# EAGLE design discoball-v2 (EAGLE 9.5.0)
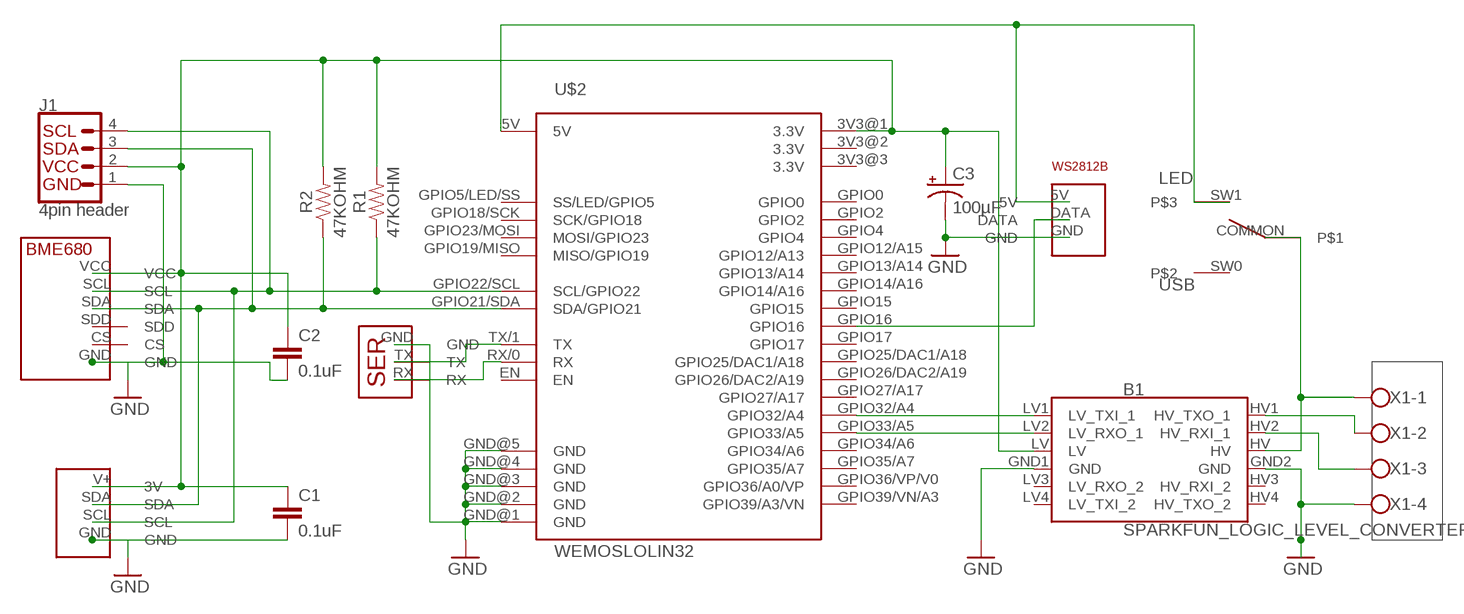
[diagram p0: schematic, sheet 1]

## Parts
B1  SPARKFUN_LOGIC_LEVEL_CONVERTER  [SPARKFUN_LOGIC_LEVEL_CONVERTER]
C1  0.1uF  0.1UF-KIT-EZ-50V-20%  [CAP-PTH-SMALL-KIT]
C2  0.1uF  0.1UF-KIT-EZ-50V-20%  [CAP-PTH-SMALL-KIT]
C3  100µF  CAP_POLPTH1  [CPOL-RADIAL-100UF-25V]
J1  4pin header  QWIIC_CONNECTORJS-1MM  [1X04_1MM_RA]
R1  47KOHM  [AXIAL-0.3-KIT]
R2  47KOHM  [AXIAL-0.3-KIT]
U$1  BME680BREAKOUT  [BME680BREAKOUT]
U$2  WEMOSLOLIN32  [LOLIN32VAR1]
U$3  I2CHEADER  [I2CHEADER]
U$4  SPDTSWITCH  [SPDTSWITCH]
U$6  SERIALHEADER  [SERIALHEADER]
U$7  WS2812BHEADER  [WS2812BHEADER]
X1  W237-4  [W237-4]

## Nets
3.3V: B1.LV C1.1 C2.1 C3.1(+) J1.2(VCC) R1.P$2 R2.P$2 U$1.VCC U$2.3V3@1(3.3V) U$3.V+(3V)
5V: U$2.5V U$4.SW1 U$7.5V
GND: B1.GND1(GND) B1.GND2(GND) C1.2 C2.2 C3.2(-) J1.1(GND) U$1.GND U$2.GND@1(GND) U$2.GND@2(GND) U$2.GND@3(GND) U$2.GND@4(GND) U$2.GND@5(GND) U$3.GND U$6.GND U$7.GND X1.4
N$1: J1.4(SCL) R1.P$1 U$1.SCL U$2.GPIO22/SCL(SCL/GPIO22) U$3.SCL
N$2: J1.3(SDA) R2.P$1 U$1.SDA U$2.GPIO21/SDA(SDA/GPIO21) U$3.SDA
N$3: B1.HV2(HV_RXI_1) X1.3
N$4: U$2.RX/0(RX) U$6.RX
N$5: B1.LV1(LV_TXI_1) U$2.GPIO32/A4
N$6: B1.LV2(LV_RXO_1) U$2.GPIO33/A5
N$7: U$2.TX/1(TX) U$6.TX
N$8: B1.HV1(HV_TXO_1) X1.2
N$9: B1.HV U$4.COMMON X1.1
N$11: U$2.GPIO16 U$7.DATA
Unconnected: B1.HV3(HV_RXI_2) B1.HV4(HV_TXO_2) B1.LV3(LV_RXO_2) B1.LV4(LV_TXI_2) U$1.CS U$1.SDD U$2.3V3@2(3.3V) U$2.EN U$2.GPIO0 U$2.GPIO2 U$2.GPIO4 U$2.GPIO5/LED/SS(SS/LED/GPIO5) U$2.GPIO12/A15(GPIO12/A13) U$2.GPIO13/A14 U$2.GPIO14/A16 U$2.GPIO15 U$2.GPIO17 U$2.GPIO18/SCK(SCK/GPIO18) U$2.GPIO19/MISO(MISO/GPIO19) U$2.GPIO23/MOSI(MOSI/GPIO23) U$2.GPIO25/DAC1/A18 U$2.GPIO26/DAC2/A19 U$2.GPIO27/A17 U$2.GPIO34/A6 U$2.GPIO35/A7 U$2.GPIO36/VP/V0(GPIO36/A0/VP) U$2.GPIO39/VN/A3(GPIO39/A3/VN) U$4.SW0

## Notes on the sheet
- LED
- USB

## Power pins joined to a net without a drawn wire
3.3V: U$2.3V3@3(3.3V)

## Library data of the parts
B1 = SparkFun-Boards:SPARKFUN_LOGIC_LEVEL_CONVERTER: SparkFun Logic Level Converter -Bi-Directional This is the mechnical outline for the 3.3V - 5V bi directional logic level converter. *Note, the "LOCK" Package has the header pins staggered by an offset of 5 mils (off center line), so that when you slide a row of standard 0.1" headers into the PTH pads, it will hold position vertically. See the follwing turorial for more information on this type of special footprints: Sneaky Footprints <https://www.sparkfun.com/tutorials/114> SparkFun Products: SparkFun Logic Level Converter - Bi-Directional <https://www.sparkfun.com/products/12009>
C1 C2 = SparkFun-Capacitors:0.1UF: 0.1µF ceramic capacitors A capacitor is a passive two-terminal electrical component used to store electrical energy temporarily in an electric field.; PROD_ID: CAP-08370
C3 = SparkFun:CAP_POL: Capacitor Polarized These are standard SMD and PTH capacitors. Normally 10uF, 47uF, and 100uF in electrolytic and tantalum varieties. Always verify the external diameter of the through hole cap, it varies with capacity, voltage, and manufacturer. The EIA devices should be standard.
J1 = SparkFun-Connectors:QWIIC_CONNECTOR: SparkFun I2C Standard Qwiic Connector An SMD 1mm pitch JST connector makes it easy and quick (get it? Qwiic?) to connect I2C devices to each other. The Qwiic system <http://www.sparkfun.com/qwiic> enables fast and solderless connection between popular platforms and various sensors and actuators. We carry 200mm <https://www.sparkfun.com/products/14204>, 100mm <https://www.sparkfun.com/products/14205>, 50mm <https://www.sparkfun.com/products/14206>, and breadboard friendly <https://www.sparkfun.com/products/14207> Qwiic cables. We also offer 10 pcs strips <https://www.sparkfun.com/products/14323> the SMD connectors.
R1 R2 = LOLIN32:47KOHM: 47kΩ resistor A resistor is a passive two-terminal electrical component that implements electrical resistance as a circuit element. Resistors act to reduce current flow, and, at the same time, act to lower voltage levels within circuits. - Wikipedia
U$1 = LOLIN32:BME680BREAKOUT
U$2 = LOLIN32:WEMOSLOLIN32: WEMOS LOLIN32 CPU with Wifi and 4Gb flash storage
U$3 = LOLIN32:I2CHEADER
U$4 = LOLIN32:SPDTSWITCH
U$6 = LOLIN32:SERIALHEADER
U$7 = LOLIN32:WS2812BHEADER: WS2812B RGB LED header
X1 = con-wago-500:W237-4: WAGO SCREW CLAMP; OC_FARNELL: unknown; OC_NEWARK: unknown

## Board
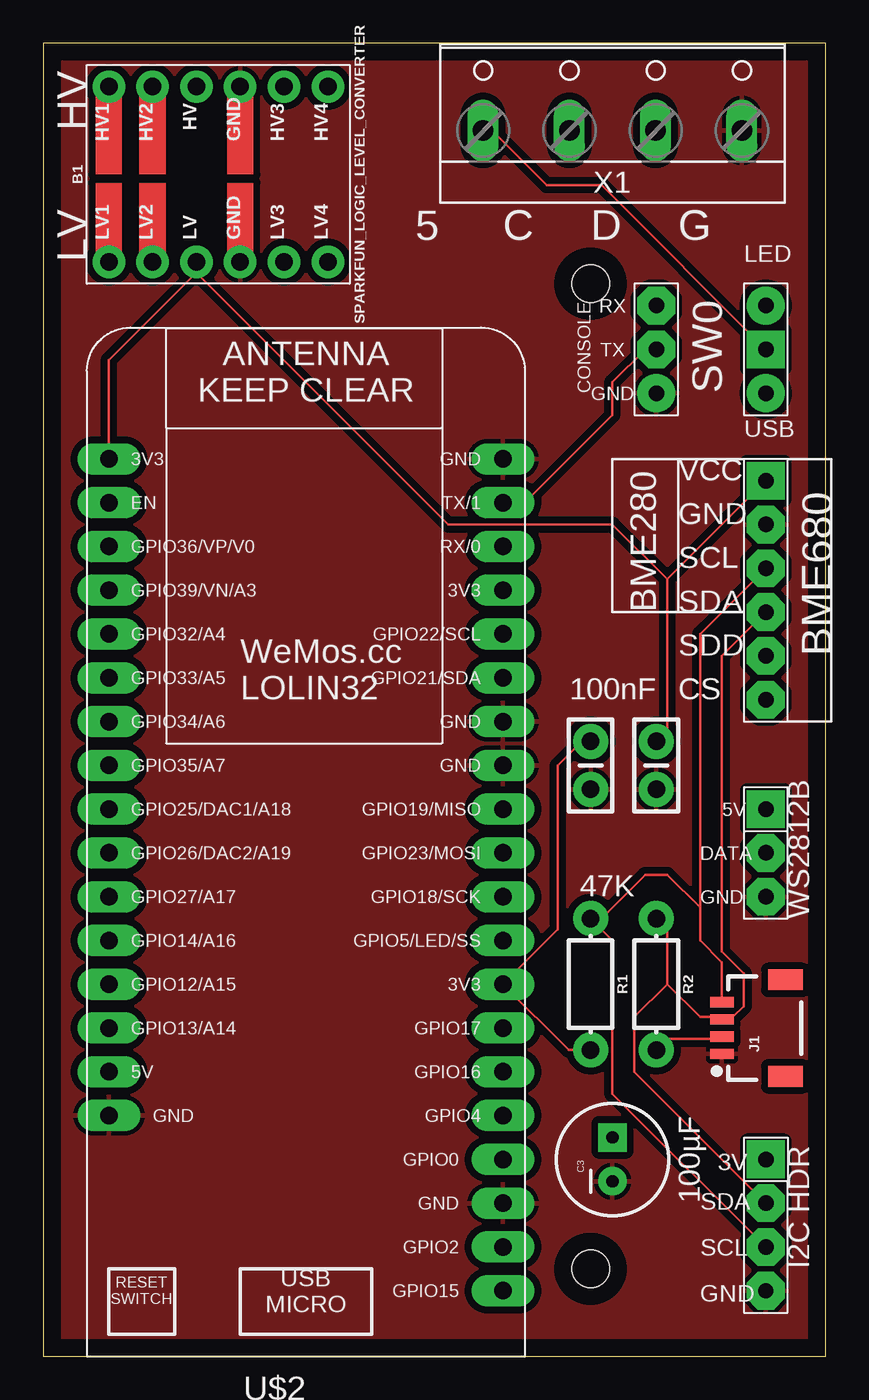
[diagram p1: board, top side]
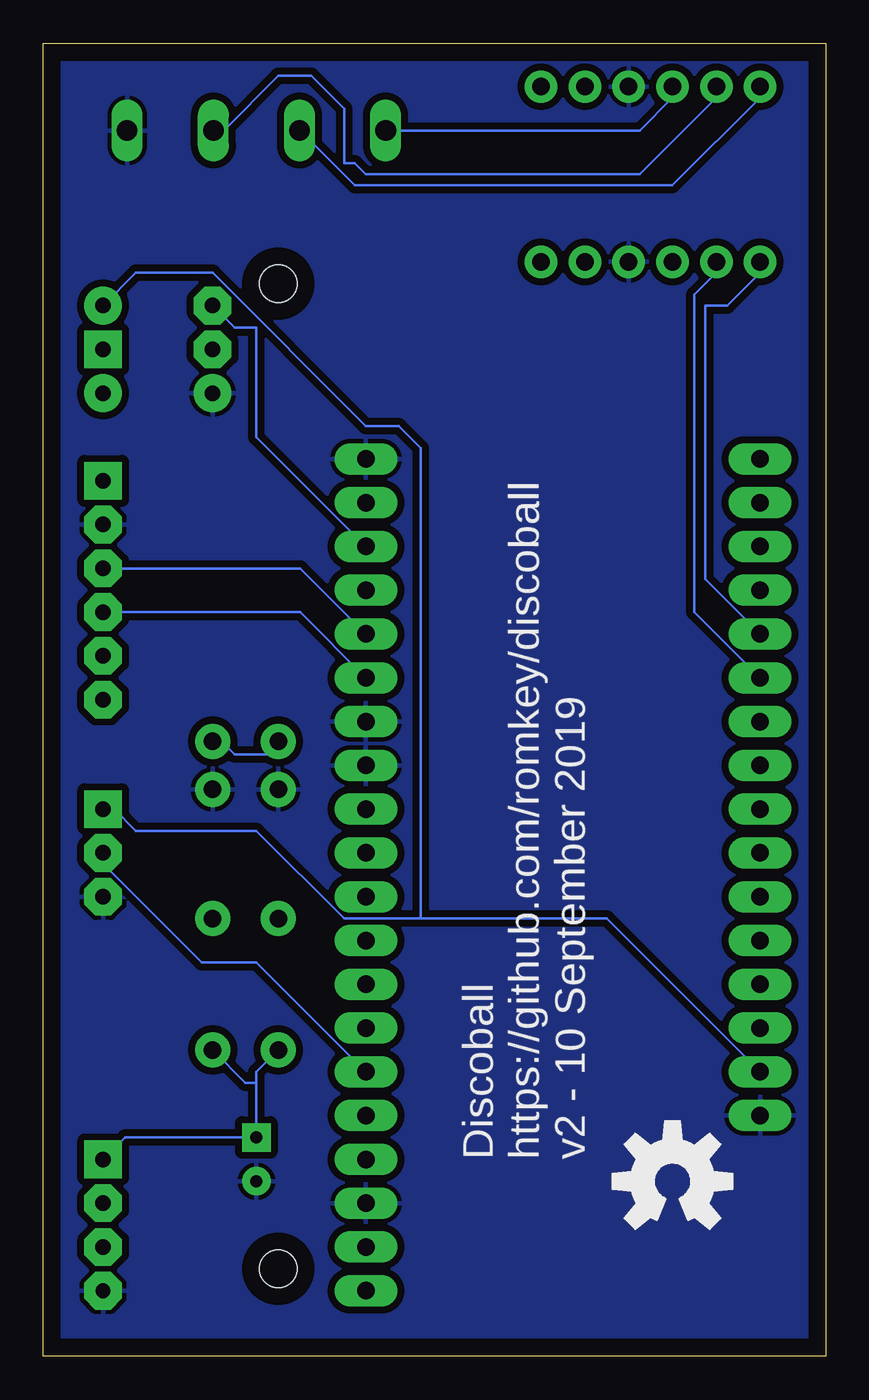
[diagram p2: board, bottom side, seen from below]

Size 45.39 x 76.19 mm. Coordinates in mm from the lower left corner, seen from the top.
Outline: 0,0 45.39,0 45.39,76.19 0,76.19 0,0
Copper layers (1*16): Top 0.035mm / dielectric 1.5mm / Bottom 0.035mm
Design rules "default": minimum track width 6mil, minimum drill 0.35mm, track to track 6mil, track to pad 6mil, pad to pad 6mil, via to via 6mil, smd to smd 6mil, copper to edge 40mil, drill to drill 6mil, minimum pad ring 10mil, minimum via ring 8mil, stop-mask expansion 4mil, vias tented up to drill 0mil, thermal gap 10mil
Holes 2.16 mm at 31.75,5.08 31.75,62.23

### Footprints (pad centres in the part's own frame; a part is rotated, then mirrored left to right if it is on the bottom)
SPARKFUN_LOGIC_LEVEL_CONVERTER = drill 1.016 pad 1.88: GND1 -5.08,-1.27; GND2 5.08,-1.27; HV 5.08,1.27; HV1 5.08,6.35; HV2 5.08,3.81; HV3 5.08,-3.81; HV4 5.08,-6.35; LV -5.08,1.27; LV1 -5.08,6.35; LV2 -5.08,3.81; LV3 -5.08,-3.81; LV4 -5.08,-6.35
CAP-PTH-SMALL-KIT = drill 1.016 pad 2.032: 1 -1.397,0; 2 1.397,0
CPOL-RADIAL-100UF-25V = drill 0.7 pad 1.651 square: 1 1.27,0 | drill 0.7 pad 1.651: 2 -1.27,0
1X04_1MM_RA = smd 0.6 x 1.35: 1 -1.5,0; 2 -0.5,0; 3 0.5,0; 4 1.5,0 | smd 1.2 x 2: NC1 2.8,-3.675; NC2 -2.8,-3.675
AXIAL-0.3-KIT = drill 1.016 pad 2.032: P$1 -3.81,0; P$2 3.81,0
BME680BREAKOUT = drill 0.9 pad 2.184 octagon: CS 2.54,2.54; GND 2.54,12.7; SCL 2.54,10.16; SDA 2.54,7.62; SDD 2.54,5.08 | drill 0.9 pad 2.184 square: VCC 2.54,15.24
LOLIN32VAR1 = drill 1.016 pad 1.829 long: 3V3@1 -11.43,24.13; 3V3@2 11.43,16.51; 3V3@3 11.43,-6.35; 5V -11.43,-11.43; EN -11.43,21.59; GND@1 11.43,24.13; GND@2 11.43,8.89; GND@3 11.43,6.35; GND@4 11.43,-19.05; GND@5 -11.43,-13.97; GPIO0 11.43,-16.51; GPIO2 11.43,-21.59; GPIO4 11.43,-13.97; GPIO5/LED/SS 11.43,-3.81; GPIO12/A15 -11.43,-6.35; GPIO13/A14 -11.43,-8.89; GPIO14/A16 -11.43,-3.81; GPIO15 11.43,-24.13; GPIO16 11.43,-11.43; GPIO17 11.43,-8.89; GPIO18/SCK 11.43,-1.27; GPIO19/MISO 11.43,3.81; GPIO21/SDA 11.43,11.43; GPIO22/SCL 11.43,13.97; GPIO23/MOSI 11.43,1.27; GPIO25/DAC1/A18 -11.43,3.81; GPIO26/DAC2/A19 -11.43,1.27; GPIO27/A17 -11.43,-1.27; GPIO32/A4 -11.43,13.97; GPIO33/A5 -11.43,11.43; GPIO34/A6 -11.43,8.89; GPIO35/A7 -11.43,6.35; GPIO36/VP/V0 -11.43,19.05; GPIO39/VN/A3 -11.43,16.51; RX/0 11.43,19.05; TX/1 11.43,21.59
I2CHEADER = drill 0.85 pad 2.184 octagon: GND 3.81,1.27 | drill 0.9 pad 2.184 octagon: SCL 3.81,3.81; SDA 3.81,6.35 | drill 0.9 pad 2.184 square: V+ 3.81,8.89
SPDTSWITCH = drill 0.9 pad 2.184 square: COMMON 1.27,3.81 | drill 0.9 pad 2.184: SW0 1.27,6.35; SW1 1.27,1.27
SERIALHEADER = drill 0.9 pad 2.184: GND 1.27,1.27 | drill 0.9 pad 2.184 octagon: RX 1.27,6.35; TX 1.27,3.81
WS2812BHEADER = drill 0.9 pad 2.184 square: 5V -2.54,7.62 | drill 0.9 pad 2.184 octagon: DATA -2.54,5.08; GND -2.54,2.54
W237-4 = drill 1.194 long: 1 -7.5,-1.27; 2 -2.5,-1.27; 3 2.5,-1.27; 4 7.5,-1.27

### Placement (x,y rotation side)
B1  10.16,68.58 90 top
C1  31.75,34.29 270 top
C2  35.56,34.29 270 top
C3  33.02,11.43 90 top
J1  39.37,19.05 90 top
R1  31.75,21.59 270 top
R2  35.56,21.59 270 top
U$1  39.37,35.56 0 top
U$2  15.24,27.94 0 top
U$3  38.1,2.54 0 top
U$4  43.18,62.23 180 top
U$5  [OSHW-LOGO-L]  8.89,10.16 0 bottom
U$6  34.29,54.61 0 top
U$7  44.45,24.13 0 top
X1  33.02,72.39 0 top

### Tracks (layer width: path | path; a pad name or v marks a point on that pad's centre or on a via)
3.3V
  Top 0.152: R2.P$2 36.2,18.41 39.37,18.41 J1.2 | R1.P$2 30.48,17.78 U$2.3V3@3 29.84,24.77 29.84,34.29 31.75,36.2 C1.1 | U$2.3V3@1 3.81,57.78 8.89,62.87 | 36.2,45.09 U$1.VCC | 36.2,45.09 36.2,36.2 35.56,35.56 C2.1 | 8.89,62.87 23.5,48.26 33.02,48.26 36.2,45.09 | 8.89,62.87 B1.LV
  Bottom 0.152: 33.02,15.88 33.02,16.51 R1.P$2 | 33.02,15.88 C3.1 40.64,12.7 U$3.V+ | R2.P$2 33.66,15.88 33.02,15.88 | C1.1 31.75,35.56 32.38,34.92 34.29,34.92 34.92,35.56 35.56,35.56 C2.1
5V
  Bottom 0.152: U$2.5V 12.7,25.4 23.5,25.4 | 23.5,25.4 27.94,25.4 33.02,30.48 40.01,30.48 41.27,31.75 U$7.5V | U$4.SW1 40.01,62.87 35.56,62.87 26.67,53.98 24.77,53.98 23.5,52.7 23.5,25.4
GND
  pour Top (isolate 0.406): 0,76.2 0,0 45.72,0 45.72,76.2
  pour Bottom (isolate 0.406): 0,76.2 0,0 45.72,0 45.72,76.2
N$1
  Top 0.152: 38.1,26.04 38.1,24.13 39.37,22.86 J1.4 39.37,20.32 | 38.1,26.04 36.2,27.94 34.92,27.94 32.38,25.4 R1.P$1 33.02,24.13 33.02,15.24 U$3.SCL | U$1.SCL 38.1,41.91 38.1,26.04
  Bottom 0.152: U$2.GPIO22/SCL 30.48,45.72 U$1.SCL
N$2
  Top 0.152: 39.37,19.68 38.1,19.68 36.2,21.59 | 36.2,21.59 36.2,24.77 R2.P$1 | U$3.SDA 34.29,16.51 34.29,19.68 36.2,21.59 | U$1.SDA 39.37,40.64 39.37,23.5 40.64,22.23 40.64,20.32 40.01,19.68 39.37,19.68 | 39.37,19.68 J1.3
  Bottom 0.152: U$2.GPIO21/SDA 30.48,43.18 U$1.SDA
N$3
  Bottom 0.152: B1.HV2 6.35,73.03 10.79,68.58 26.67,68.58 27.3,69.22 27.94,69.22 27.94,72.39 29.84,74.3 31.75,74.3 34.92,71.12 X1.3
N$4
  Bottom 0.152: U$2.RX/0 33.02,53.34 33.02,59.69 34.29,59.69 U$6.RX
N$5
  Bottom 0.152: U$2.GPIO32/A4 6.99,45.09 6.99,60.96 5.71,60.96 3.81,62.87 B1.LV1
N$6
  Bottom 0.152: U$2.GPIO33/A5 7.62,43.18 7.62,61.59 6.35,62.87 B1.LV2
N$7
  Top 0.152: U$2.TX/1 27.94,49.53 33.02,54.61 33.02,56.52 34.92,58.42 U$6.TX
N$8
  Bottom 0.152: B1.HV1 3.81,73.03 8.89,67.94 27.3,67.94 30.48,71.12 X1.2
N$9
  Top 0.152: U$4.COMMON 32.38,67.94 29.21,67.94 26.04,71.12 X1.1
  Bottom 0.152: X1.1 10.79,71.12 8.89,73.03 B1.HV
N$11
  Bottom 0.152: U$2.GPIO16 33.02,22.86 36.2,22.86 41.91,28.57 U$7.DATA
(copper drawn outside any net)
  shapes: Top area x6

### Text on the board
tPlace: HV | 5 | C | D | G | LV | LED | CONSOLE | SW0 | USB | BME280 | 100nF | 47K | 100µF
bPlace: Discoball / https://github.com/romkey/discoball / v2 - 10 September 2019